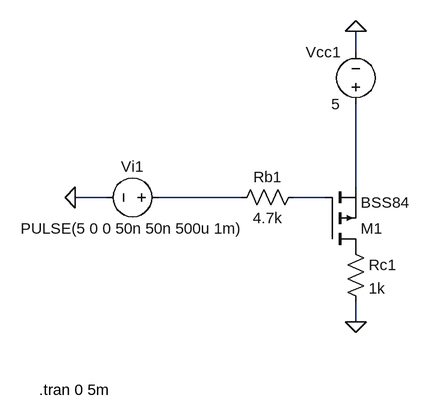
[diagram p0: schematic lab5_task2.asc]
lab5_task2.asc, the LTspice schematic file:
Version 4
SHEET 1 1040 680
WIRE 416 -144 416 -176
WIRE 416 64 416 -64
WIRE 32 80 -16 80
WIRE 240 80 112 80
WIRE 368 80 320 80
WIRE 416 272 416 240
FLAG 416 272 0
FLAG -16 80 0
FLAG 416 -176 0
SYMBOL voltage 416 -48 R180
WINDOW 0 24 96 Left 2
WINDOW 3 24 16 Left 2
WINDOW 123 0 0 Left 0
WINDOW 39 24 68 Left 2
SYMATTR InstName Vcc1
SYMATTR Value 5
SYMBOL voltage 128 80 R90
WINDOW 0 -32 56 VBottom 2
WINDOW 3 32 56 VTop 2
WINDOW 123 0 0 Left 0
WINDOW 39 0 0 Left 0
SYMATTR InstName Vi1
SYMATTR Value PULSE(5 0 0 50n 50n 500u 1m)
SYMBOL res 400 144 R0
SYMATTR InstName Rc1
SYMATTR Value 1k
SYMBOL pmos 368 160 M180
SYMATTR InstName M1
SYMATTR Value BSS84
SYMBOL res 336 64 R90
WINDOW 0 0 56 VBottom 2
WINDOW 3 32 56 VTop 2
SYMATTR InstName Rb1
SYMATTR Value 4.7k
TEXT -72 376 Left 2 !.tran 0 5m

The netlist it stands for:
* lab5_task2.asc
Vcc1 N001 0 5
Vi1 N002 0 PULSE(5 0 0 50n 50n 500u 1m)
Rc1 P001 0 1k
M1 P001 N003 N001 N001 BSS84
Rb1 N003 N002 4.7k
.model NMOS NMOS
.model PMOS PMOS
.lib standard.mos
.tran 0 5m
.backanno
.end